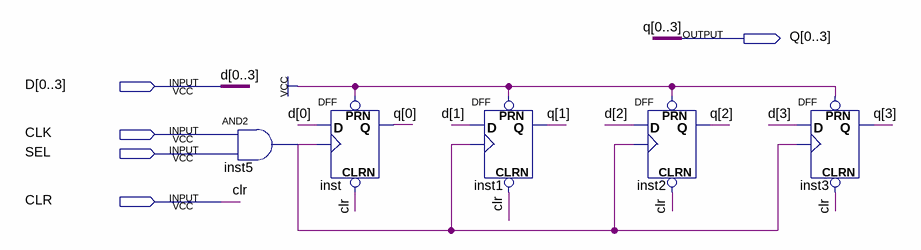
[diagram p0: schematic sheet]
// Quartus schematic register.bdf as structural Verilog: 5 symbols, 5 pins
module register (
  input  [0:3] D,
  input  CLK,
  input  SEL,
  input  CLR,
  output [0:3] Q
);

  wire inst5_out;

  and inst5 (inst5_out, CLK, SEL);
  DFF inst (.CLRN(CLR), .CLK(inst5_out), .D(D[0]), .PRN(1'b1), .Q(Q[0]));
  DFF inst1 (.CLRN(CLR), .CLK(inst5_out), .D(D[1]), .PRN(1'b1), .Q(Q[1]));
  DFF inst2 (.CLRN(CLR), .CLK(inst5_out), .D(D[2]), .PRN(1'b1), .Q(Q[2]));
  DFF inst3 (.CLRN(CLR), .CLK(inst5_out), .D(D[3]), .PRN(1'b1), .Q(Q[3]));
endmodule
